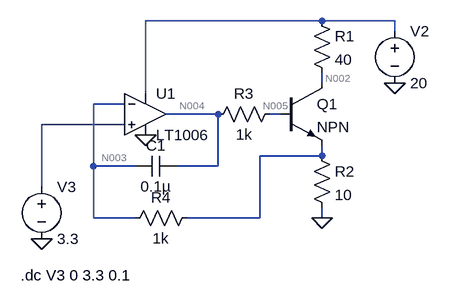
[diagram p0: schematic high_current_source.asc]
high_current_source.asc, the LTspice schematic file:
Version 4.1
SHEET 1 880 680
WIRE 336 -256 64 -256
WIRE 448 -256 336 -256
WIRE 448 -240 448 -256
WIRE 336 -160 336 -176
WIRE 64 -144 64 -256
WIRE 32 -128 -16 -128
WIRE 176 -112 96 -112
WIRE 272 -112 256 -112
WIRE 32 -96 -96 -96
WIRE 336 -48 336 -64
WIRE 336 -48 240 -48
WIRE -16 -32 -16 -128
WIRE 48 -32 -16 -32
WIRE 176 -32 176 -112
WIRE 176 -32 112 -32
WIRE -96 0 -96 -96
WIRE -16 48 -16 -32
WIRE 48 48 -16 48
WIRE 240 48 240 -48
WIRE 240 48 128 48
WIRE 336 48 336 32
FLAG 64 -80 0
FLAG 336 48 0
FLAG -96 80 0
FLAG 448 -160 0
SYMBOL npn 272 -160 R0
SYMATTR InstName Q1
SYMBOL OpAmps\\LT1006 64 -176 R0
SYMATTR InstName U1
SYMBOL voltage 448 -256 R0
WINDOW 123 0 0 Left 0
WINDOW 39 0 0 Left 0
SYMATTR InstName V2
SYMATTR Value 20
SYMBOL res 320 -272 R0
SYMATTR InstName R1
SYMATTR Value 40
SYMBOL res 320 -64 R0
SYMATTR InstName R2
SYMATTR Value 10
SYMBOL voltage -96 -16 R0
WINDOW 123 0 0 Left 0
WINDOW 39 0 0 Left 0
SYMATTR InstName V3
SYMATTR Value 3.3
SYMBOL res 272 -128 R90
WINDOW 0 0 56 VBottom 2
WINDOW 3 32 56 VTop 2
SYMATTR InstName R3
SYMATTR Value 1k
SYMBOL cap 112 -48 R90
WINDOW 0 0 32 VBottom 2
WINDOW 3 32 32 VTop 2
SYMATTR InstName C1
SYMATTR Value 0.1µ
SYMBOL res 144 32 R90
WINDOW 0 0 56 VBottom 2
WINDOW 3 32 56 VTop 2
SYMATTR InstName R4
SYMATTR Value 1k
TEXT -128 136 Left 2 !.dc V3 0 3.3 0.1

The netlist it stands for:
* high_current_source.asc
Q1 N002 N005 N007 0 NPN
X§U1 N006 N003 N001 0 N004 LT1006  ; pins In+ In- V+ V- OUT
V2 N001 0 20
R1 N001 N002 40
R2 N007 0 10
V3 N006 0 3.3
R3 N005 N004 1k
C1 N004 N003 0.1µ
R4 N007 N003 1k
.model NPN NPN
.model PNP PNP
.lib standard.bjt
.dc V3 0 3.3 0.1
.lib LTC.lib
.backanno
.end

* Results of the author's LTspice run, read from the files saved beside the schematic
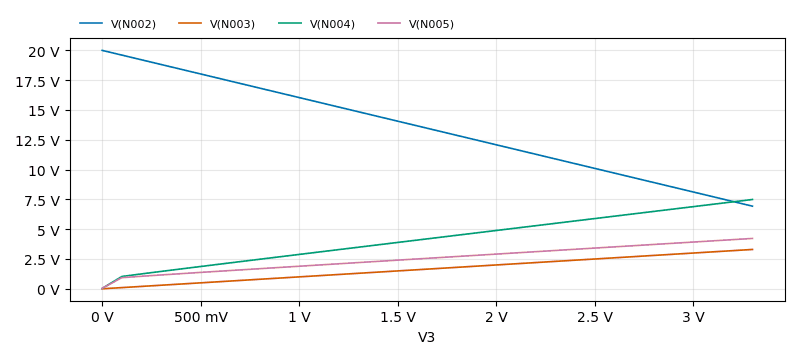
[diagram p1: DC transfer characteristic of high_current_source.asc, plotted from the saved traces]
* DC transfer characteristic, 1 run:
*   V(N002): 20 V at V3=0 V, 6.931 V at V3=3.3 V, min 6.931 V, max 20 V
*   V(N003): 9.918 µV at V3=0 V, 3.3 V at V3=3.3 V, min 9.918 µV, max 3.3 V
*   V(N004): 33.9 mV at V3=0 V, 7.491 V at V3=3.3 V, min 33.9 mV, max 7.491 V
*   V(N005): 33.9 mV at V3=0 V, 4.224 V at V3=3.3 V, min 33.9 mV, max 4.224 V